# Altium schematic sheet Sheet_MP3Player(DAC)_V3.0.schdoc
size 406 x 222 mm
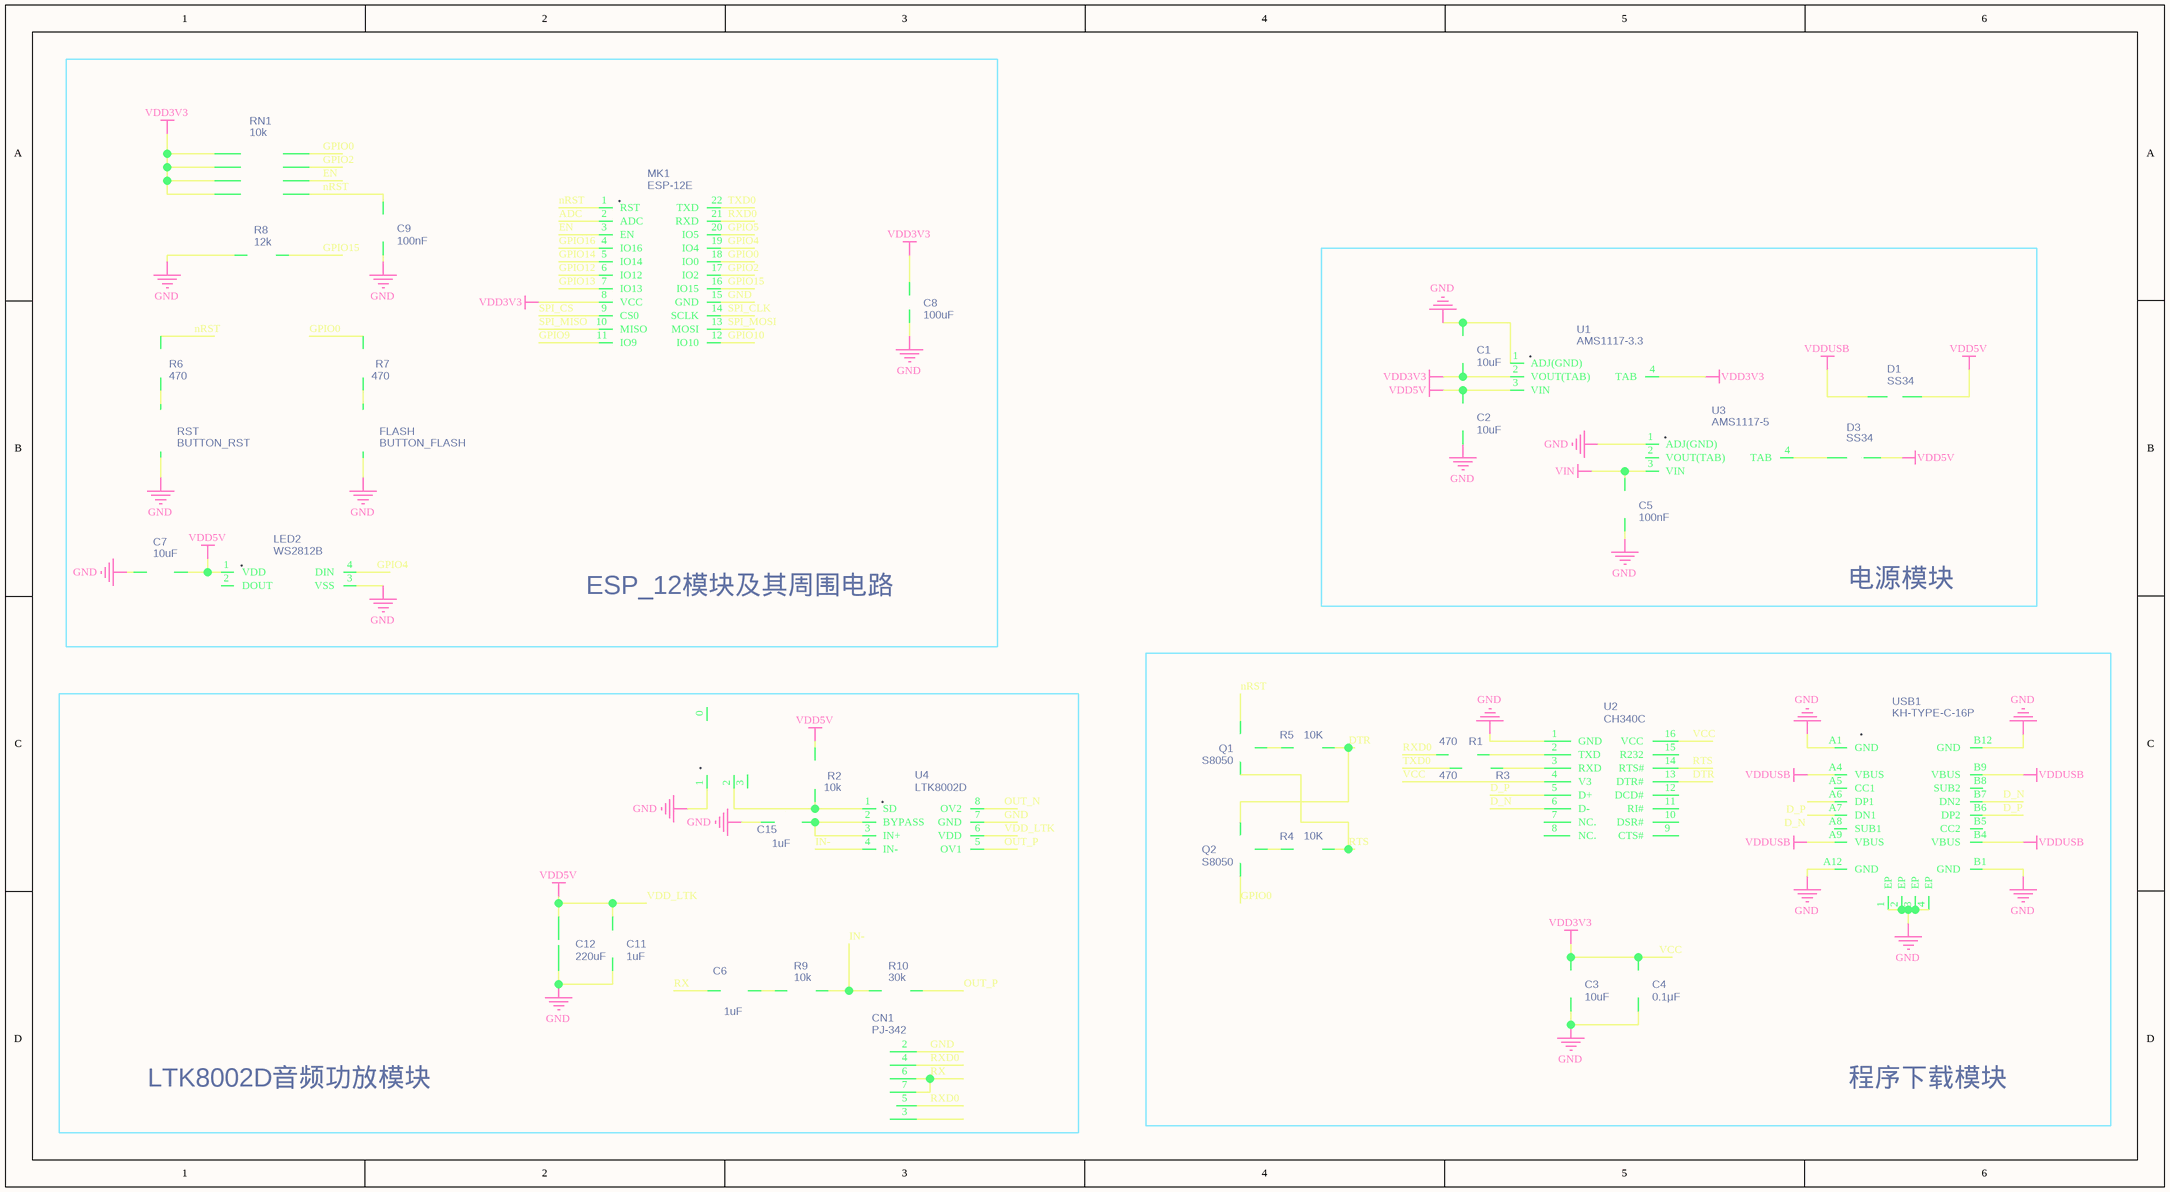
[diagram p0: Sheet_MP3Player(DAC)_V3.0.schdoc]

## Parts
C1  10uF  [C0603]
C2  10uF  [C0603]
C3  10uF  [C0603]
C4  0.1μF  [C0603]
C5  100nF  [C0603]
C6  1uF  [C0603]
C7  10uF  [C0603]
C8  100uF  [CAP-SMD_L3.5-W2.8-R-RD]
C9  100nF  [C0603]
C11  1uF  [C0603]
C12  220uF  [CAP-SMD_BD6.3-L6.6-W6.6-RD]
C15  1uF  [C0603]
CN1  PJ-342  [AUDIO-SMD_PJ-342]
D1  SS34  [SMA_L4.4-W2.8-LS5.4-RD]
D3  SS34  [SMA_L4.4-W2.8-LS5.4-RD]
FLASH  BUTTON_FLASH  [SMT_SW_PTS_820]
LED2  WS2812B  [LED-SMD_4P-L5.0-W5.0-TL]
MK1  ESP-12E  [WIFIM-SMD_ESP-12E-BR]
OPEN1  SK-3296S-01-L1  [SW-SMD_3P-P1.50_L2.7-W6.6]  (value not drawn)
Q1  S8050  [SOT-23-3_L2.9-W1.3-P1.90-LS2.4-BR]
Q2  S8050  [SOT-23-3_L2.9-W1.3-P1.90-LS2.4-BR]
R1  470  [R0603]
R2  10k  [R0603]
R3  470  [R0603]
R4  10K  [R0603]
R5  10K  [R0603]
R6  470  [R0603]
R7  470  [R0603]
R8  12k  [R0603]
R9  10k  [R0603]
R10  30k  [R0603]
RN1  10k  [RES-ARRAY-SMD_0603-8P-L3.2-W1.6-BL]
RST  BUTTON_RST  [SMT_SW_PTS_820]
U1  AMS1117-3.3  [SOT-223_L6.7-W3.5-P2.30-BR]
U2  CH340C  [SOP-16_L10.0-W3.9-P1.27-LS6.0-BL]
U3  AMS1117-5  [SOT-223_L6.7-W3.5-P2.30-BR]
U4  LTK8002D  [SOP-8_L4.9-W3.9-P1.27-LS6.0-BL]
USB1  KH-TYPE-C-16P  [USB-C-SMD_KH-TYPE-C-16P]

## Blocks framed on the sheet
ESP_12模块及其周围电路: C7-C9 FLASH LED2 MK1 R6-R8 RN1 RST
电源模块: C1 C2 C5 D1 D3 U1 U3
程序下载模块: C3 C4 Q1 Q2 R1 R3-R5 U2 USB1
LTK8002D音频功放模块: C6 C11 C12 C15 CN1 OPEN1 R2 R9 R10 U4

## Nets
GND: C1.1 C2.2 C3.2 C4.2 C5.2 C7.1 C8.2 C9.2 C11.1 C12.2 C15.2 CN1.2 FLASH.2 LED2.3(VSS) MK1.15(GND) OPEN1.1 R8.2 RST.2 U1.1(ADJ(GND)) U2.1(GND) U3.1(ADJ(GND)) U4.7(GND) USB1.1(EP) USB1.2(EP) USB1.3(EP) USB1.4(EP) USB1.A1(GND) USB1.A12(GND) USB1.B1(GND) USB1.B12(GND)
VCC: C1.2 C3.1 C4.1 C8.1 MK1.8(VCC) RN1.5 RN1.6 RN1.7 RN1.8 U1.2(VOUT(TAB)) U1.4(TAB) U2.4(V3) U2.16(VCC)  [also labelled VDD3V3]
VDD_LTK: C2.1 C7.2 C11.2 C12.1 D1.1(C) D3.1(K) LED2.1(VDD) R2.2 U1.3(VIN) U4.6(VDD)  [also labelled VDD5V]
VDDUSB: D1.2(A) USB1.A4(VBUS) USB1.A9(VBUS) USB1.B4(VBUS) USB1.B9(VBUS)
VIN: C5.1 U3.3(VIN)
ADC: MK1.2(ADC)
D_N: U2.6(D-) USB1.A7(DN1) USB1.B7(DN2)
D_P: U2.5(D+) USB1.A6(DP1) USB1.B6(DP2)
DTR: Q2.2(E) R5.2 U2.13(DTR#)
EN: MK1.3(EN) RN1.2
GPIO0: MK1.18(IO0) Q2.3(C) R7.2 RN1.4
GPIO2: MK1.17(IO2) RN1.3
GPIO4: LED2.4(DIN) MK1.19(IO4)
GPIO5: MK1.20(IO5)
GPIO9: MK1.11(IO9)
GPIO10: MK1.12(IO10)
GPIO12: MK1.6(IO12)
GPIO13: MK1.7(IO13)
GPIO14: MK1.5(IO14)
GPIO15: MK1.16(IO15) R8.1
GPIO16: MK1.4(IO16)
IN-: R9.1 R10.2 U4.4(IN-)
nRST: C9.1 MK1.1(RST) Q1.3(C) R6.2 RN1.1
OUT_N: U4.8(OV2)
OUT_P: R10.1 U4.5(OV1)
RTS: Q1.2(E) R4.2 U2.14(RTS#)
RX: C6.2 CN1.6 CN1.7
RXD0: CN1.4 CN1.5 MK1.21(RXD) R1.2
SPI_CLK: MK1.14(SCLK)
SPI_CS: MK1.9(CS0)
SPI_MISO: MK1.10(MISO)
SPI_MOSI: MK1.13(MOSI)
TXD0: MK1.22(TXD) R3.2
NetC6_1: C6.1 R9.2
NetC15_1: C15.1 U4.2(BYPASS) U4.3(IN+)
NetD3_2: D3.2(A) U3.4(TAB)
NetFLASH_1: FLASH.1 R7.1
NetOPEN1_2: OPEN1.2 R2.1 U4.1(SD)
NetQ1_1: Q1.1(B) R5.1
NetQ2_1: Q2.1(B) R4.1
NetR1_1: R1.1 U2.2(TXD)
NetR3_1: R3.1 U2.3(RXD)
NetR6_1: R6.1 RST.1

Not connected (* = marked no-connect by the designer): CN1 3; LED2 2(DOUT); OPEN1 0 3; U2 7(NC.) 8(NC.) 9(CTS#) 10(DSR#) 11(RI#) 12(DCD#) 15(R232); U3 2(VOUT(TAB)); USB1 A5(CC1) A8(SUB1) B5(CC2) B8(SUB2)

## Library data of the parts
C1-C3 C7 = 10uF: BOM_Manufacturer: Walsin Tech Corp; BOM_Manufacturer Part: 0603B101K500CT; nameAlias: Capacitance; Contributor: LCSC; BOM_Supplier: LCSC; BOM_Supplier Part: C338150; BOM_JLCPCB Part Class: Extended Part; spicePre: C; spiceSymbolName: 0603B101K500CT
C4 = 0.1μF: BOM_Manufacturer: Walsin Tech Corp; BOM_Manufacturer Part: 0603B101K500CT; nameAlias: Capacitance; Contributor: LCSC; BOM_Supplier: LCSC; BOM_Supplier Part: C338150; BOM_JLCPCB Part Class: Extended Part; spicePre: C; spiceSymbolName: 0603B101K500CT
C5 C9 = 100nF: BOM_Manufacturer: Walsin Tech Corp; BOM_Manufacturer Part: 0603B101K500CT; nameAlias: Capacitance; Contributor: LCSC; BOM_Supplier: LCSC; BOM_Supplier Part: C338150; BOM_JLCPCB Part Class: Extended Part; spicePre: C; spiceSymbolName: 0603B101K500CT
C6 C11 C15 = 1uF: BOM_Manufacturer: Walsin Tech Corp; BOM_Manufacturer Part: 0603B101K500CT; nameAlias: Capacitance; Contributor: LCSC; BOM_Supplier: LCSC; BOM_Supplier Part: C338150; BOM_JLCPCB Part Class: Extended Part; spicePre: C; spiceSymbolName: 0603B101K500CT
C8 = 100uF: BOM_Manufacturer: AVX; BOM_Manufacturer Part: TAJB107M006RNJ; nameAlias: Capacitance; BOM_Supplier: LCSC; BOM_Supplier Part: C7195; BOM_JLCPCB Part Class: Extended Part; spicePre: C; spiceSymbolName: TAJB107M006RNJ
C12 = 220uF: BOM_Manufacturer: Lelon; BOM_Manufacturer Part: VZT221M1ETR-0607; nameAlias: Capacitance; Contributor: LCSC; BOM_Supplier: LCSC; BOM_Supplier Part: C371974; BOM_JLCPCB Part Class: Extended Part; spicePre: C; spiceSymbolName: VZT221M1ETR-0607
CN1 = PJ-342: BOM_Manufacturer: SHOU HAN; Contributor: LCSC; BOM_Supplier: LCSC; BOM_Supplier Part: C668606; BOM_Manufacturer Part: PJ-342; BOM_JLCPCB Part Class: Extended Part; spicePre: C; spiceSymbolName: PJ-342
D1 = SS34: BOM_Manufacturer: STARSEA; BOM_Paste Type: expand; BOM_Supplier: LCSC; BOM_Manufacturer Part: SS34; image: //image.lceda.cn/szlcsc/C83961.jpg; BOM_Supplier Part: C83961; spicePre: D; spiceSymbolName: SS34_C83961
D3 = SS34: BOM_Manufacturer Part: SS14; BOM_Manufacturer: MDD; BOM_Supplier: LCSC; BOM_Supplier Part: C2480; BOM_JLCPCB Part Class: Basic Part; spicePre: D; spiceSymbolName: SS14
FLASH = BUTTON_FLASH: Contributor: dingding1; spicePre: S; spiceSymbolName: SMT_SW_PTS_820
LED2 = WS2812B: BOM_Manufacturer: Worldsemi; Contributor: LCSC; BOM_Supplier: LCSC; BOM_Manufacturer Part: WS2812B; BOM_Supplier Part: C114585; BOM_JLCPCB Part Class: Extended Part; spicePre: L; spiceSymbolName: WS2812B
MK1 = ESP-12E: BOM_Manufacturer: Ai-Thinker; BOM_Supplier: LCSC; BOM_Manufacturer Part: ESP-12E; BOM_Supplier Part: C89297; BOM_JLCPCB Part Class: Extended Part; spicePre: M; spiceSymbolName: ESP-12E
OPEN1 = SK-3296S-01-L1: BOM_Manufacturer: XKB Enterprise; Contributor: LCSC; BOM_Supplier: LCSC; BOM_Supplier Part: C319020; BOM_Manufacturer Part: SK-3296S-01-L1; spicePre: S; spiceSymbolName: SK-3296S-01-L1
Q1 Q2 = S8050: BOM_Manufacturer: JSMSEMI; Contributor: LCSC; BOM_Supplier: LCSC; BOM_Supplier Part: C916390; BOM_Manufacturer Part: S8050; BOM_JLCPCB Part Class: Extended Part; spicePre: Q; spiceSymbolName: S8050
R1 R3 R6 R7 = 470: BOM_Manufacturer: YAGEO; BOM_Manufacturer Part: RC0603JR-079K1L; nameAlias: Resistance (Ohms); BOM_Supplier: LCSC; BOM_Supplier Part: C137602; BOM_JLCPCB Part Class: Extended Part; spicePre: R; spiceSymbolName: RC0603JR-079K1L
R2 R9 = 10k: BOM_Manufacturer: YAGEO; BOM_Manufacturer Part: RC0603JR-079K1L; nameAlias: Resistance (Ohms); BOM_Supplier: LCSC; BOM_Supplier Part: C137602; BOM_JLCPCB Part Class: Extended Part; spicePre: R; spiceSymbolName: RC0603JR-079K1L
R4 R5 = 10K: BOM_Manufacturer: YAGEO; BOM_Manufacturer Part: RC0603JR-079K1L; nameAlias: Resistance (Ohms); BOM_Supplier: LCSC; BOM_Supplier Part: C137602; BOM_JLCPCB Part Class: Extended Part; spicePre: R; spiceSymbolName: RC0603JR-079K1L
R8 = 12k: BOM_Manufacturer: YAGEO; BOM_Manufacturer Part: RC0603JR-079K1L; nameAlias: Resistance (Ohms); BOM_Supplier: LCSC; BOM_Supplier Part: C137602; BOM_JLCPCB Part Class: Extended Part; spicePre: R; spiceSymbolName: RC0603JR-079K1L
R10 = 30k: BOM_Manufacturer: YAGEO; BOM_Manufacturer Part: RC0603JR-079K1L; nameAlias: Resistance (Ohms); BOM_Supplier: LCSC; BOM_Supplier Part: C137602; BOM_JLCPCB Part Class: Extended Part; spicePre: R; spiceSymbolName: RC0603JR-079K1L
RN1 = 10k: BOM_Manufacturer: YAGEO; BOM_Manufacturer Part: YC164-FR-071KL; nameAlias: Resistance (Ohms); BOM_Supplier: LCSC; BOM_Supplier Part: C110021; spicePre: R; spiceSymbolName: YC164-FR-071KL
RST = BUTTON_RST: Contributor: dingding1; spicePre: S; spiceSymbolName: SMT_SW_PTS_820
U1 = AMS1117-3.3: BOM_Manufacturer: Youtai Semiconductor Co., Ltd.; Contributor: LCSC; BOM_Paste Type: expand; BOM_Supplier: LCSC; BOM_Supplier Part: C347222; BOM_Manufacturer Part: AMS1117-3.3; spicePre: U; spiceSymbolName: AMS1117-3.3_C347222
U2 = CH340C: BOM_Manufacturer: WCH; BOM_Supplier: LCSC; BOM_Manufacturer Part: CH340C; BOM_Supplier Part: C84681; BOM_JLCPCB Part Class: Extended Part; spicePre: U; spiceSymbolName: CH340C
U3 = AMS1117-5: BOM_Manufacturer: Youtai Semiconductor Co., Ltd.; BOM_Manufacturer Part: AMS1117-3.3; Contributor: LCSC; BOM_Paste Type: expand; BOM_Supplier: LCSC; BOM_Supplier Part: C347222; spicePre: U; spiceSymbolName: AMS1117-3.3_C347222
U4 = LTK8002D: BOM_Manufacturer: LTKCHIP; Contributor: LCSC; BOM_Supplier: LCSC; BOM_Supplier Part: C406248; BOM_Manufacturer Part: LTK8002D; BOM_JLCPCB Part Class: Extended Part; spicePre: U; spiceSymbolName: LTK8002D
USB1 = KH-TYPE-C-16P: BOM_Manufacturer: Shenzhen Kinghelm Elec; Contributor: LCSC; BOM_Supplier: LCSC; BOM_Supplier Part: C709357; BOM_Manufacturer Part: KH-TYPE-C-16P; BOM_JLCPCB Part Class: Extended Part; spicePre: U; spiceSymbolName: KH-TYPE-C-16P